# EAGLE design Right Ear Board (EAGLE 8.6.1)
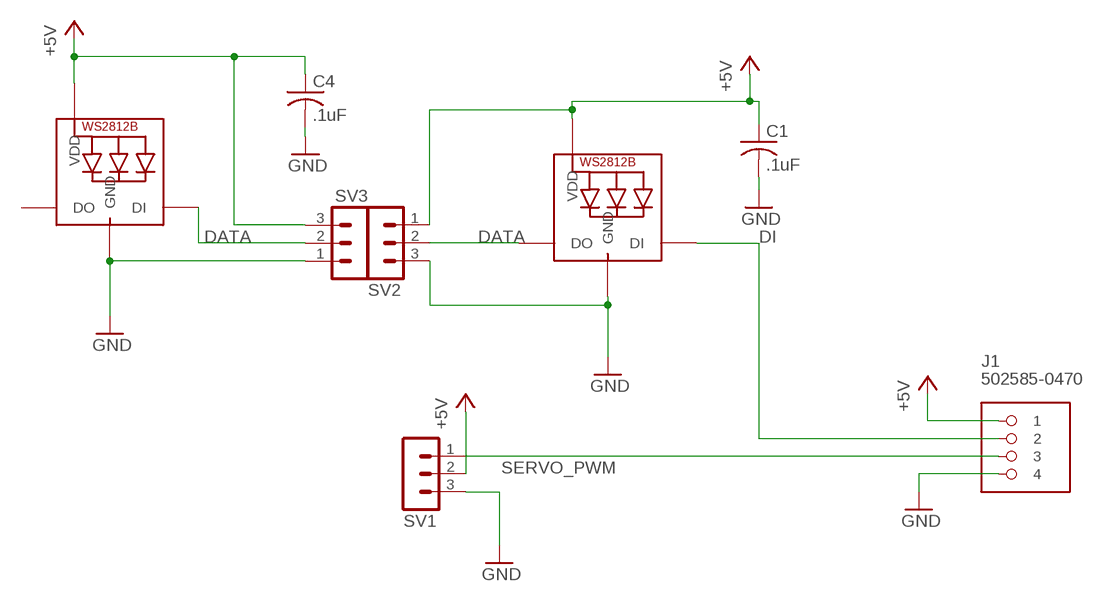
[diagram p0: schematic, sheet 1]

## Parts
C1  .1uF  C-USC0603K  [C0603K]
C4  .1uF  C-USC0603K  [C0603K]
J1  502585-0470  MOLEX_CLICKMATE-4-R/A  [MOLEX-CLIKMATE-4-R/A]
LED1  WS2812B5050  [WS2812B]
LED7  WS2812B5050  [WS2812B]
SV1  MA03-1  [MA03-1]
SV2  MA03-1  [MA03-1]
SV3  MA03-1  [MA03-1]

## Nets
+5V: C1.1 C4.1 J1.1 LED1.1-VDD(VDD) LED7.1-VDD(VDD) SV1.2 SV2.1 SV3.3
DATA: LED1.2-DOUT(DO) LED7.4-DIN(DI) SV2.2 SV3.2
DI: J1.2 LED1.4-DIN(DI)
GND: C1.2 C4.2 J1.4 LED1.3-GND(GND) LED7.3-GND(GND) SV1.3 SV2.3 SV3.1
SERVO_PWM: J1.3 SV1.1
Unconnected: LED7.2-DOUT(DO)

## Library data of the parts
C1 C4 = rcl:C-US: CAPACITOR, American symbol; PARTNO: GRM188R61A106KE69D
J1 = FormE:MOLEX_CLICKMATE-4-R/A
LED1 LED7 = adafruit:WS2812B
SV1-SV3 = con-lstb:MA03-1: PIN HEADER; OC_FARNELL: unknown; OC_NEWARK: unknown

## Board
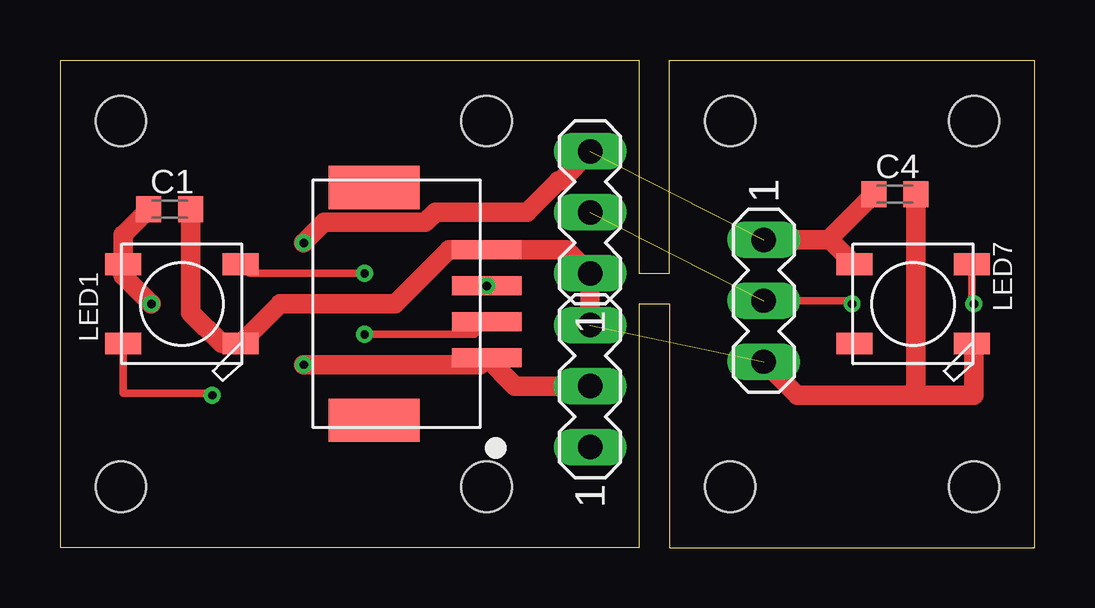
[diagram p1: board, top side]
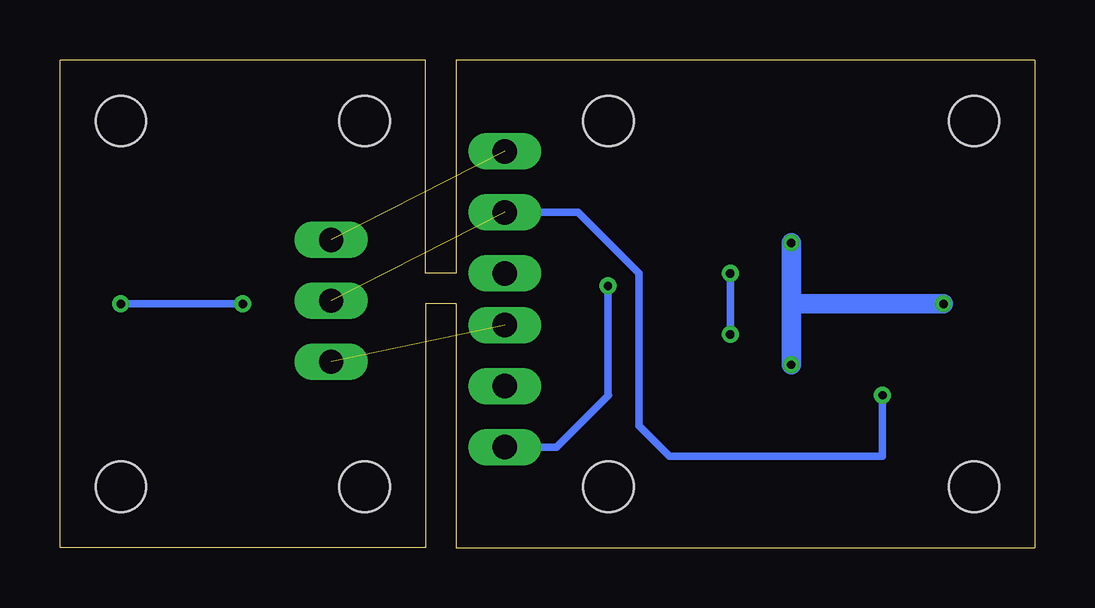
[diagram p2: board, bottom side, seen from below]

Size 40.64 x 20.32 mm. Coordinates in mm from the lower left corner, seen from the top.
Outline: 40.64,0 40.64,20.32 25.4,20.32 25.4,11.43 24.13,11.43 24.13,20.32 0,20.32 0,0 24.13,0 24.13,10.16 25.4,10.16 25.4,0 40.64,0
Copper layers (1*16): Top 0.0356mm / dielectric 1.5011mm / Bottom 0.0356mm
Design rules "OSH_PCB Rules": minimum track width 6mil, minimum drill 13mil, track to track 6mil, track to pad 6mil, pad to pad 6mil, via to via 6mil, smd to smd 6mil, copper to edge 15mil, drill to drill 6mil, minimum pad ring 7mil, minimum via ring 7mil, stop-mask expansion 3mil, vias tented up to drill 0mil, thermal gap 10mil
Holes 2.1 mm at 2.54,17.78 2.54,2.54 17.78,2.54 17.78,17.78 27.94,17.78 38.1,17.78 27.94,2.54 38.1,2.54

### Footprints (pad centres in the part's own frame; a part is rotated, then mirrored left to right if it is on the bottom)
C0603K = smd 1.05 x 1.08: 1 -0.875,0; 2 0.875,0
MOLEX-CLIKMATE-4-R/A = smd 0.8 x 2.9: 1 2.25,3.7; 2 0.75,3.7; 3 -0.75,3.7; 4 -2.25,3.7 | smd 1.8 x 3.8: M1 4.85,-1; M2 -4.85,-1
WS2812B = smd 1.5 x 0.9: 1-VDD 2.45,-1.65; 2-DOUT 2.45,1.65; 3-GND -2.45,1.65; 4-DIN -2.45,-1.65
MA03-1 = drill 1.016 long: 1 -2.54,0; 2 0,0; 3 2.54,0

### Placement (x,y rotation side)
C1  4.57,14.1 0 top
C4  34.8,14.73 0 top
J1  14.1,10.16 270 top
LED1  5.08,10.16 180 top
LED7  35.56,10.16 180 top
SV1  22.1,6.73 90 top
SV2  29.34,10.29 270 top
SV3  22.1,13.97 90 top

### Tracks (layer width: path | path; a pad name or v marks a point on that pad's centre or on a via)
+5V  (via drill 0.35)  (1 unrouted)
  Top 0.813: SV2.1 32.09,12.83 | 32.09,12.83 LED7.1-VDD | C4.1 32.09,12.9 32.09,12.83 | C1.1 2.63,13.03 LED1.1-VDD 2.63,11.34 v3.81,10.16 | SV3.3 20.88,15.29 20.79,15.29 19.47,13.97 15.65,13.97 15.23,13.55 11.01,13.55 v10.16,12.7 | v10.16,7.62 17.51,7.62 J1.1 18.98,6.73 SV1.2
  Bottom 0.813: v10.16,12.7 10.16,10.16 | 10.16,10.16 v10.16,7.62 | v3.81,10.16 10.16,10.16
DATA  (via drill 0.35)  (1 unrouted)
  Top 0.305: SV2.2 32.89,10.29 v33.02,10.16 | v38.1,10.16 38.01,10.25 LED7.4-DIN | LED1.2-DOUT 2.63,6.44 6.26,6.44 v6.35,6.35
  Bottom 0.305: v33.02,10.16 v38.1,10.16 | SV3.2 19.05,13.97 16.51,11.43 16.51,5.08 15.24,3.81 6.35,3.81 v6.35,6.35
DI  (via drill 0.35)
  Top 0.305: LED1.4-DIN 7.91,11.43 v12.7,11.43 | v12.7,8.89 17.28,8.89 J1.2
  Bottom 0.305: v12.7,11.43 v12.7,8.89
GND  (1 unrouted)
  Top 0.813: SV1.3 SV3.1 21.12,12.41 J1.4 16.22,12.41 13.97,10.16 9.18,10.16 LED1.3-GND 6.73,8.51 5.45,9.79 C1.2 | SV2.3 30.73,6.35 35.56,6.35 | 35.56,6.35 38.1,6.35 38.1,8.42 LED7.3-GND | C4.2 35.67,6.46 35.56,6.35
SERVO_PWM  (via drill 0.35)
  Bottom 0.305: SV1.1 19.94,4.19 17.78,6.35 17.8,6.37 J1.3
  other vias: 17.8,10.91